# EAGLE design third (EAGLE 9.6.2)
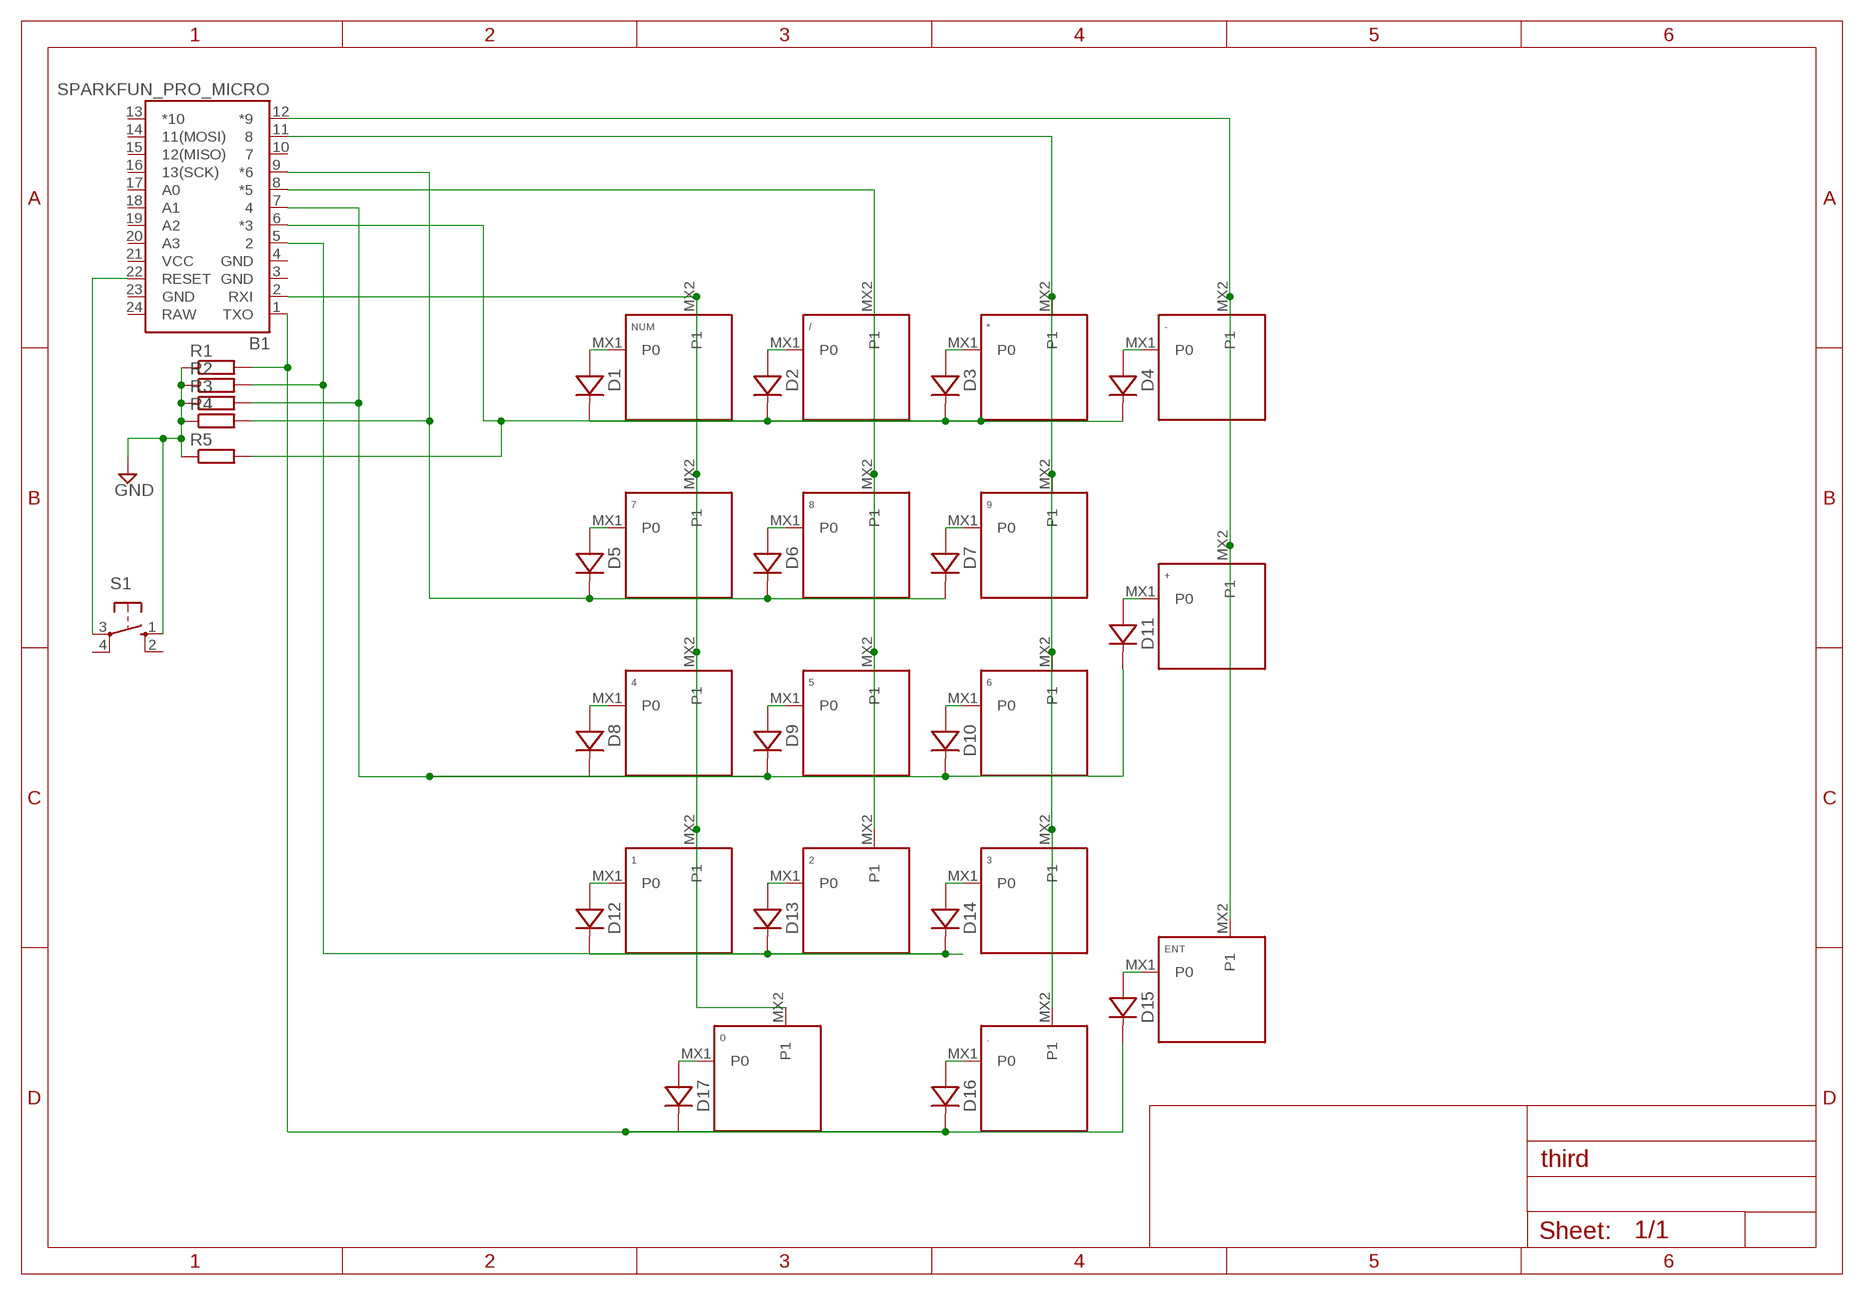
[diagram p0: schematic, sheet 1]

## Parts
0  KEYSWITCH-PLAIN-MX-2U-FLIPPED  [MX-2U-FLIPPED]
1  KEYSWITCH-PLAIN-MX-1U  [MX-1U]
2  KEYSWITCH-PLAIN-MX-1U  [MX-1U]
3  KEYSWITCH-PLAIN-MX-1U  [MX-1U]
4  KEYSWITCH-PLAIN-MX-1U  [MX-1U]
5  KEYSWITCH-PLAIN-MX-1U  [MX-1U]
6  KEYSWITCH-PLAIN-MX-1U  [MX-1U]
7  KEYSWITCH-PLAIN-MX-1U  [MX-1U]
8  KEYSWITCH-PLAIN-MX-1U  [MX-1U]
9  KEYSWITCH-PLAIN-MX-1U  [MX-1U]
*  KEYSWITCH-PLAIN-MX-1U  [MX-1U]
+  KEYSWITCH-PLAIN-MX-2U-ROTATED  [MX-2U-ROTATED]
-  KEYSWITCH-PLAIN-MX-1U  [MX-1U]
.  KEYSWITCH-PLAIN-MX-1U  [MX-1U]
/  KEYSWITCH-PLAIN-MX-1U  [MX-1U]
B1  SPARKFUN_PRO_MICRO  [SPARKFUN_PRO_MICRO]
D1  1N4148  DIODE-HAND  [DIODE_HAND]
D2  1N4148  DIODE-HAND  [DIODE_HAND]
D3  1N4148  DIODE-HAND  [DIODE_HAND]
D4  1N4148  DIODE-HAND  [DIODE_HAND]
D5  1N4148  DIODE-HAND  [DIODE_HAND]
D6  1N4148  DIODE-HAND  [DIODE_HAND]
D7  1N4148  DIODE-HAND  [DIODE_HAND]
D8  1N4148  DIODE-HAND  [DIODE_HAND]
D9  1N4148  DIODE-HAND  [DIODE_HAND]
D10  1N4148  DIODE-HAND  [DIODE_HAND]
D11  1N4148  DIODE-HAND  [DIODE_HAND]
D12  1N4148  DIODE-HAND  [DIODE_HAND]
D13  1N4148  DIODE-HAND  [DIODE_HAND]
D14  1N4148  DIODE-HAND  [DIODE_HAND]
D15  1N4148  DIODE-HAND  [DIODE_HAND]
D16  1N4148  DIODE-HAND  [DIODE_HAND]
D17  1N4148  DIODE-HAND  [DIODE_HAND]
ENT  KEYSWITCH-PLAIN-MX-2U-ROTATED  [MX-2U-ROTATED]
NUM  KEYSWITCH-PLAIN-MX-1U  [MX-1U]
R1  RESISTOR-THT  [THT-RESISTOR]
R2  RESISTOR-THT  [THT-RESISTOR]
R3  RESISTOR-THT  [THT-RESISTOR]
R4  RESISTOR-THT  [THT-RESISTOR]
R5  RESISTOR-THT  [THT-RESISTOR]
S1  10-XX  [B3F-10XX]

## Nets
GND: R1.1 R2.1 R3.1 R4.1 R5.1 S1.1(S)
N$1: D1.A1(A) D1.A2(A) D1.A3(A) NUM.MX1(P0)
N$2: /.MX1(P0) D2.A1(A) D2.A2(A) D2.A3(A)
N$3: *.MX1(P0) D3.A1(A) D3.A2(A) D3.A3(A)
N$4: -.MX1(P0) D4.A1(A) D4.A2(A) D4.A3(A)
N$5: 7.MX1(P0) D5.A1(A) D5.A2(A) D5.A3(A)
N$6: 8.MX1(P0) D6.A1(A) D6.A2(A) D6.A3(A)
N$7: 9.MX1(P0) D7.A1(A) D7.A2(A) D7.A3(A)
N$8: 4.MX1(P0) D8.A1(A) D8.A2(A) D8.A3(A)
N$9: 5.MX1(P0) D9.A1(A) D9.A2(A) D9.A3(A)
N$10: 6.MX1(P0) D10.A1(A) D10.A2(A) D10.A3(A)
N$11: +.MX1(P0) D11.A1(A) D11.A2(A) D11.A3(A)
N$12: 1.MX1(P0) D12.A1(A) D12.A2(A) D12.A3(A)
N$13: 2.MX1(P0) D13.A1(A) D13.A2(A) D13.A3(A)
N$14: 3.MX1(P0) D14.A1(A) D14.A2(A) D14.A3(A)
N$15: D15.A1(A) D15.A2(A) D15.A3(A) ENT.MX1(P0)
N$16: ..MX1(P0) D16.A1(A) D16.A2(A) D16.A3(A)
N$17: 0.MX1(P0) D17.A1(A) D17.A2(A) D17.A3(A)
N$18: 0.MX2(P1) 1.MX2(P1) 4.MX2(P1) 7.MX2(P1) B1.2(RXI) NUM.MX2(P1)
N$19: 2.MX2(P1) 5.MX2(P1) 8.MX2(P1) /.MX2(P1) B1.8(*5)
N$20: 3.MX2(P1) 6.MX2(P1) 9.MX2(P1) *.MX2(P1) ..MX2(P1) B1.11
N$21: B1.6(*3) D1.C1(C) D1.C2(C) D1.C3(C) D2.C1(C) D2.C2(C) D2.C3(C) D3.C1(C) D3.C2(C) D3.C3(C) D4.C1(C) D4.C2(C) D4.C3(C) R5.2
N$22: B1.9(*6) D5.C1(C) D5.C2(C) D5.C3(C) D6.C1(C) D6.C2(C) D6.C3(C) D7.C1(C) D7.C2(C) D7.C3(C) R4.2
N$23: B1.7 D8.C1(C) D8.C2(C) D8.C3(C) D9.C1(C) D9.C2(C) D9.C3(C) D10.C1(C) D10.C2(C) D10.C3(C) D11.C1(C) D11.C2(C) D11.C3(C) R3.2
N$24: B1.5 D12.C1(C) D12.C2(C) D12.C3(C) D13.C1(C) D13.C2(C) D13.C3(C) D14.C1(C) D14.C2(C) D14.C3(C) R2.2
N$25: B1.1(TXO) D15.C1(C) D15.C2(C) D15.C3(C) D16.C1(C) D16.C2(C) D16.C3(C) D17.C1(C) D17.C2(C) D17.C3(C) R1.2
N$26: B1.22(RESET) S1.3(P)
N$27: +.MX2(P1) -.MX2(P1) B1.12(*9) ENT.MX2(P1)
Unconnected: B1.10 B1.13(*10) B1.14(11(MOSI)) B1.15(12(MISO)) B1.16(13(SCK)) B1.17(A0) B1.18(A1) B1.19(A2) B1.20(A3) S1.2(S1) S1.4(P1)

## Power pins joined to a net without a drawn wire
GND: B1.3(GND) B1.4(GND) B1.23(GND)
RAW: B1.24(RAW)
VCC: B1.21(VCC)

## Library data of the parts
0 1-9 * + - . / ENT NUM = Keyboard:KEYSWITCH-PLAIN
B1 = SparkFun-Boards:SPARKFUN_PRO_MICRO: SparkFun Pro Micro Atmega32U4 compatible footprint. SparkFun Products: 3.3V/8MHz <https://www.sparkfun.com/products/12587> 5V/16MHz <https://www.sparkfun.com/products/12640>
D1-D17 = Components:DIODE: Standard 1N4148 diode
R1-R5 = Components:RESISTOR
S1 = switch-omron:10-XX: OMRON SWITCH; MPN: B3F-1000; OC_FARNELL: 176432; OC_NEWARK: 36M3542

## Board
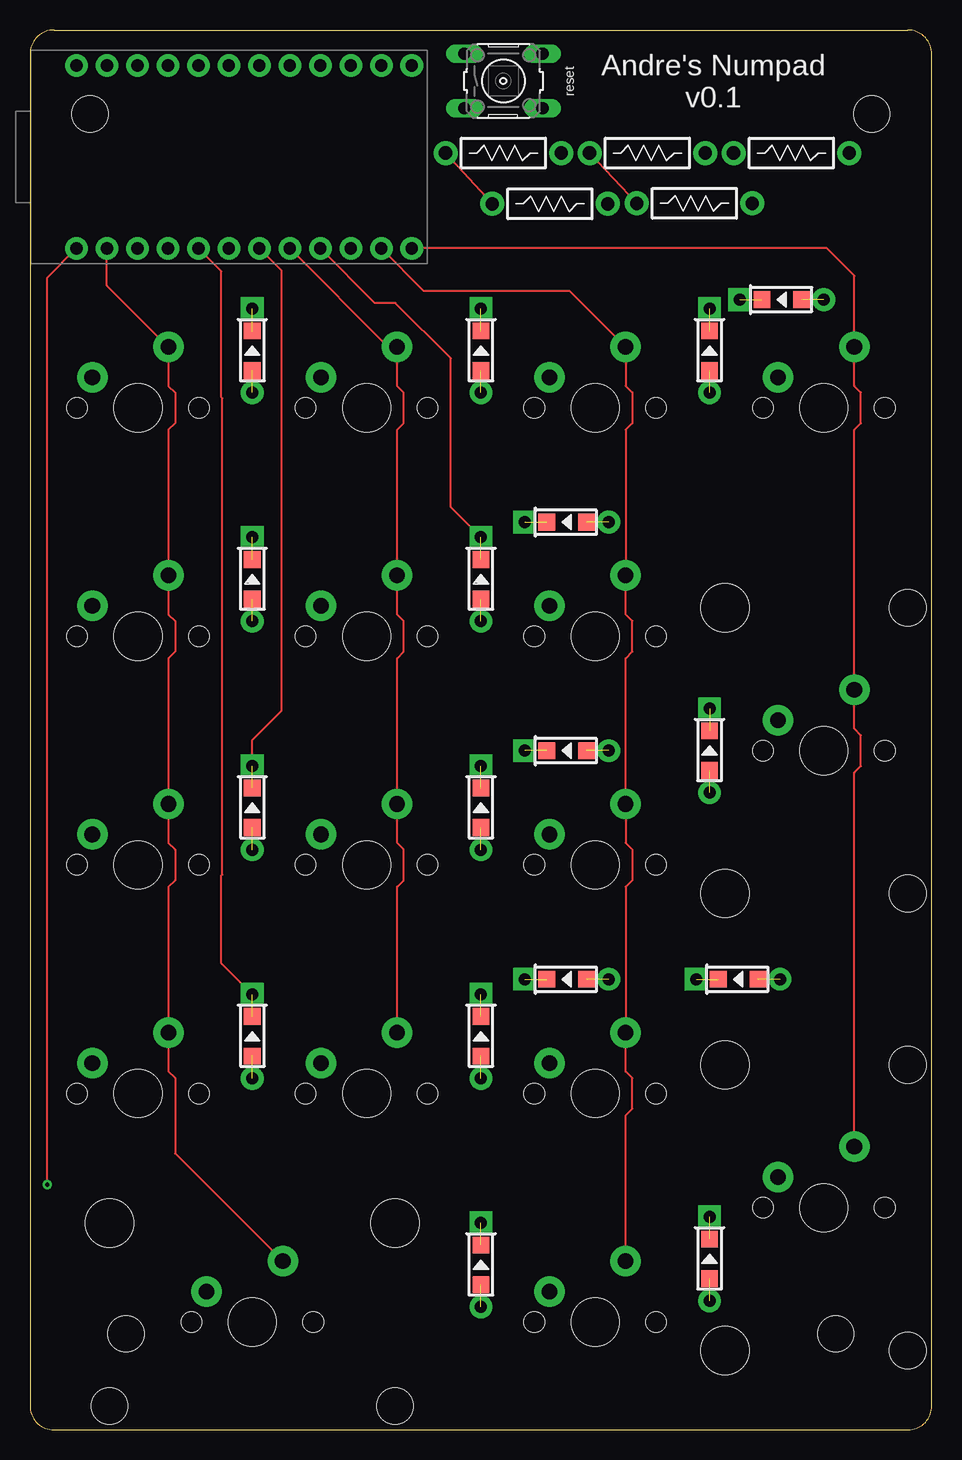
[diagram p1: board, top side]
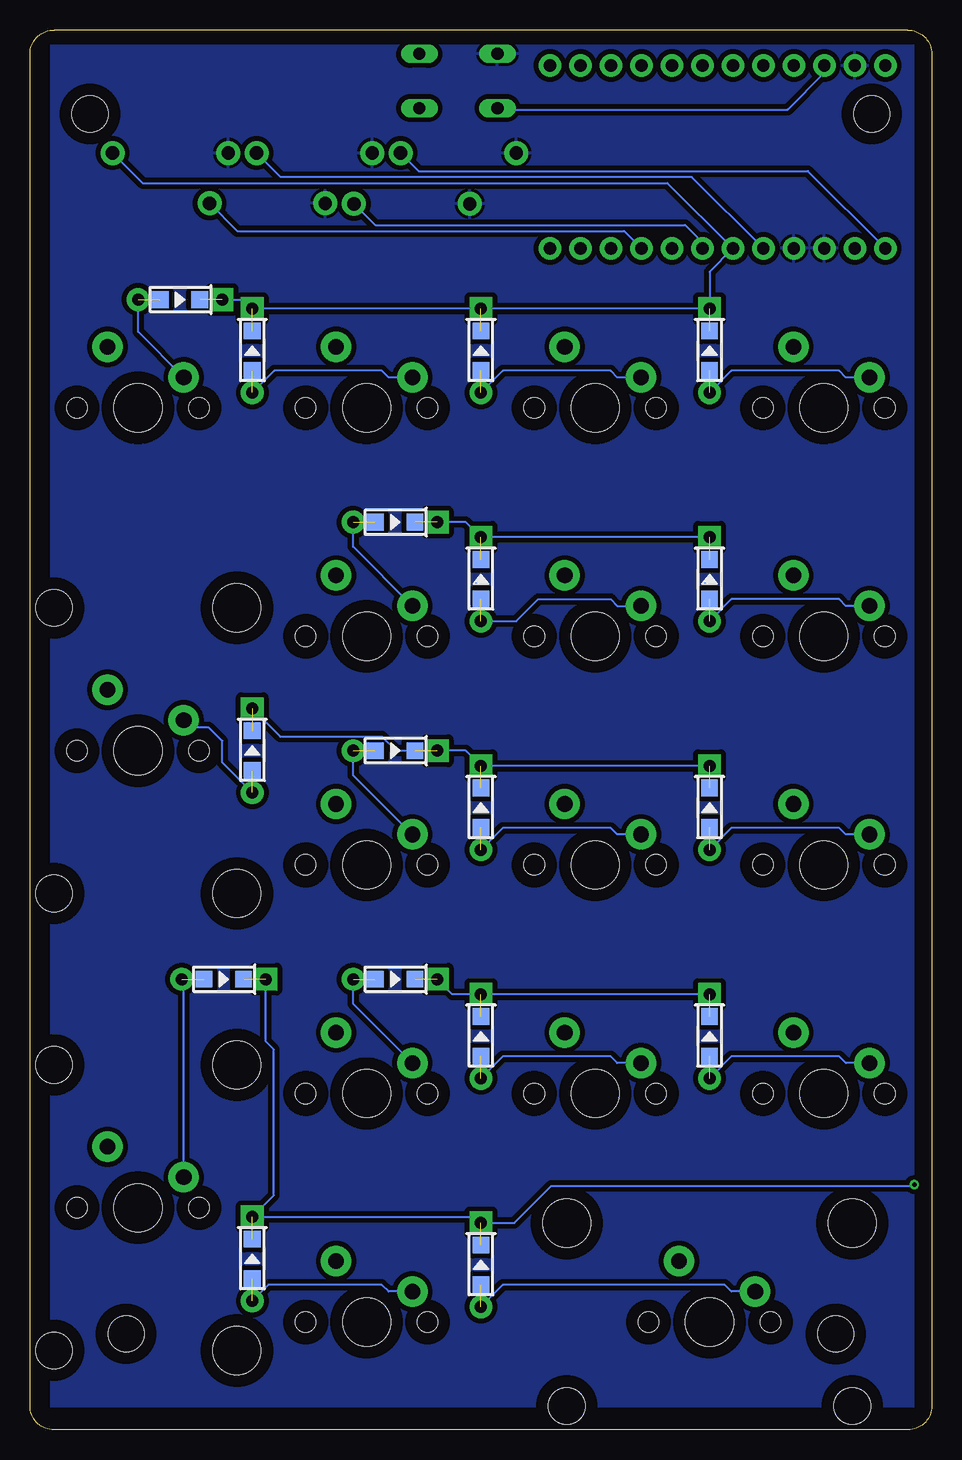
[diagram p2: board, bottom side, seen from below]

Size 75.15 x 116.7 mm. Coordinates in mm from the lower left corner, seen from the top.
Outline: 73.15,0 arc90 75.15,2
Outline: 0,2 arc90 2,0
Outline: 0,2 0,114.7 arc-90 2,116.7 73.15,116.7 arc-90 75.15,114.7 75.15,2
Outline: 2,0 73.15,0
Outline: 73.15,0 arc90 75.15,2
Outline: 0,2 arc90 2,0
Copper layers (1*16): Top 0.035mm / dielectric 1.5mm / Bottom 0.035mm
Design rules "default": minimum track width 6mil, minimum drill 0.35mm, track to track 6mil, track to pad 6mil, pad to pad 6mil, via to via 6mil, smd to smd 6mil, copper to edge 40mil, drill to drill 6mil, minimum pad ring 10mil, minimum via ring 8mil, stop-mask expansion 4mil, vias tented up to drill 0mil, thermal gap 10mil
Holes 3 mm at 5,109.71 70.15,109.7 67.14,8.01 8,8

### Footprints (pad centres in the part's own frame; a part is rotated, then mirrored left to right if it is on the bottom)
MX-2U-FLIPPED = drill 1.3 pad 2.54: MX1 -3.81,2.54; MX2 2.54,5.08 | hole 4: 0,0; -11.9,8.24; 11.9,8.24 | hole 1.7: -5.08,0; 5.08,0 | hole 3.05: -11.9,-7; 11.9,-7
MX-1U = drill 1.3 pad 2.54: MX1 -3.81,2.54; MX2 2.54,5.08 | hole 4: 0,0 | hole 1.7: -5.08,0; 5.08,0
MX-2U-ROTATED = drill 1.3 pad 2.54: MX1 -3.81,2.54; MX2 2.54,5.08 | hole 4: 0,0; -8.24,-11.9; -8.24,11.9 | hole 1.7: -5.08,0; 5.08,0 | hole 3.05: 7,-11.9; 7,11.9
SPARKFUN_PRO_MICRO = drill 1.016 pad 1.88: 1 -7.62,12.7; 2 -7.62,10.16; 3 -7.62,7.62; 4 -7.62,5.08; 5 -7.62,2.54; 6 -7.62,0; 7 -7.62,-2.54; 8 -7.62,-5.08; 9 -7.62,-7.62; 10 -7.62,-10.16; 11 -7.62,-12.7; 12 -7.62,-15.24; 13 7.62,-15.24; 14 7.62,-12.7; 15 7.62,-10.16; 16 7.62,-7.62; 17 7.62,-5.08; 18 7.62,-2.54; 19 7.62,0; 20 7.62,2.54; 21 7.62,5.08; 22 7.62,7.62; 23 7.62,10.16; 24 7.62,12.7
DIODE_HAND = smd 1.397 x 1.397: A1 -1.651,0; C1 1.651,0 | drill 1 pad 1.9: A2 -3.5,0 | smd 1.397 x 1.397 bottom: A3 -1.651,0; C3 1.651,0 | drill 1 pad 1.9 square: C2 3.5,0
THT-RESISTOR = drill 1.1 pad 2: 1 -4.82,0; 2 4.82,0
B3F-10XX = drill 1.016 long: 1 -3.251,2.261; 2 3.251,2.261; 3 -3.251,-2.261; 4 3.251,-2.261

### Placement (x,y rotation side)
0  18.52,9 0 top
1  9,28.05 0 top
2  28.05,28.05 0 top
3  47.1,28.05 0 top
4  9,47.1 0 top
5  28.05,47.1 0 top
6  47.1,47.1 0 top
7  9,66.15 0 top
8  28.05,66.15 0 top
9  47.1,66.15 0 top
*  47.1,85.2 0 top
+  66.15,56.62 0 top
-  66.15,85.2 0 top
.  47.1,9 0 top
/  28.05,85.2 0 top
B1  16.57,106.12 90 top
D1  18.52,89.96 90 top
D2  37.58,89.96 90 top
D3  56.62,89.96 90 top
D4  62.65,94.23 180 top
D5  18.52,70.91 90 top
D6  37.58,70.91 90 top
D7  44.72,75.67 180 top
D8  18.52,51.86 90 top
D9  37.58,51.86 90 top
D10  44.72,56.62 180 top
D11  56.62,56.62 90 top
D12  18.52,32.81 90 top
D13  37.58,32.81 90 top
D14  44.72,37.58 180 top
D15  59.01,37.58 180 top
D16  56.62,14.26 90 top
D17  37.58,13.76 90 top
ENT  66.15,18.52 0 top
NUM  9,85.2 0 top
R1  39.45,106.45 0 top
R2  51.45,106.45 0 top
R3  43.33,102.21 0 top
R4  55.37,102.25 0 top
R5  63.45,106.45 0 top
S1  39.45,112.45 0 top

### Tracks (layer width: path | path; a pad name or v marks a point on that pad's centre or on a via)
GND
  Top 0.152: R3.1 R1.1 | R4.1 R2.1
  pour Bottom (isolate 0.406): 1.45,1.95 1.45,115.45 73.45,115.45 73.45,1.95
N$1  (2 unrouted)
  Bottom 0.152: 5.91,87.02 NUM.MX1 7.17,87.74 7.72,88.29 16.7,88.29 D1.A2
N$2  (2 unrouted)
  Bottom 0.152: 24.96,87.02 /.MX1 26.22,87.74 26.77,88.29 35.75,88.29 D2.A2
N$3  (2 unrouted)
  Bottom 0.152: *.MX1 45.27,87.74 45.82,88.29 54.8,88.29 D3.A2
N$4  (2 unrouted)
  Bottom 0.152: -.MX1 66.15,91.55 D4.A2
N$5  (2 unrouted)
  Bottom 0.152: D5.A2 18.47,67.47 16.7,69.24 7.72,69.24 7.17,68.69 7.MX1
N$6  (2 unrouted)
  Bottom 0.152: D6.A2 34.61,67.41 32.78,69.24 26.77,69.24 26.22,68.69 8.MX1
N$7  (2 unrouted)
  Bottom 0.152: 9.MX1 48.22,73.62 D7.A2
N$8  (2 unrouted)
  Bottom 0.152: 5.91,48.92 4.MX1 7.17,49.64 7.72,50.19 16.7,50.19 D8.A2
N$9  (2 unrouted)
  Bottom 0.152: 24.96,48.92 5.MX1 26.22,49.64 26.77,50.19 35.75,50.19 D9.A2
N$10  (2 unrouted)
  Bottom 0.152: 6.MX1 48.22,54.57 D10.A2
N$11  (2 unrouted)
  Bottom 0.152: D11.A2 59.13,55.63 59.13,57.43 60.27,58.57 61.74,58.57 +.MX1
N$12  (2 unrouted)
  Bottom 0.152: 1.MX1 7.17,30.59 7.72,31.14 16.7,31.14 D12.A2
N$13  (2 unrouted)
  Bottom 0.152: 2.MX1 26.22,30.59 26.77,31.14 35.75,31.14 D13.A2
N$14  (2 unrouted)
  Bottom 0.152: 3.MX1 48.22,35.52 D14.A2
N$15  (2 unrouted)
  Bottom 0.152: ENT.MX1 62.34,37.41 D15.A2
N$16  (2 unrouted)
  Bottom 0.152: ..MX1 45.27,11.54 45.82,12.09 55.3,12.09 D16.A2
N$17  (2 unrouted)
  Bottom 0.152: 0.MX1 16.69,11.54 17.24,12.09 35.75,12.09 D17.A2
N$18
  Top 0.152: 0.MX2 12.09,23.05 12.09,29.33 11.54,29.88 1.MX2 11.54,45.27 12.09,45.82 12.09,48.38 11.54,48.93 4.MX2 11.54,64.32 12.09,64.87 12.09,67.43 11.54,67.98 7.MX2 11.54,83.37 12.09,83.92 12.09,86.48 11.54,87.03 NUM.MX2 6.41,95.41 B1.2
N$19
  Top 0.152: 2.MX2 30.59,45.27 31.14,45.82 31.14,48.38 30.59,48.93 5.MX2 30.59,64.32 31.14,64.87 31.14,67.43 30.59,67.98 8.MX2 30.59,83.37 31.14,83.92 31.14,86.48 30.59,87.03 /.MX2 29.87,90.28 B1.8
N$20
  Top 0.152: ..MX2 49.64,26.22 50.19,26.77 50.19,29.33 49.64,29.88 3.MX2 49.64,45.27 50.19,45.82 50.19,48.38 49.64,48.93 6.MX2 49.64,64.32 50.19,64.87 50.19,67.43 49.64,67.98 9.MX2 49.64,83.37 50.19,83.92 50.19,86.48 49.64,87.03 *.MX2 44.97,94.95 32.82,94.95 B1.11
N$21  (8 unrouted)
  Bottom 0.152: D4.C2 57.39,94.23 D3.C2 D2.C2 D1.C2 18.52,96.55 B1.6 22.03,103.95 65.77,103.95 R5.2
N$22  (6 unrouted)
  Top 0.152: D6.C2 35.07,76.92 35.07,89.33 30.45,93.95 28.74,93.95 B1.9
  Bottom 0.152: D5.C2 D6.C2 38.84,75.67 D7.C2 | R4.2 57.89,99.95 25.65,99.95 B1.9
N$23  (8 unrouted)
  Top 0.152: D8.C2 18.52,57.53 20.95,59.95 20.95,96.66 B1.7
  Bottom 0.152: D8.C2 D9.C2 38.84,56.62 D10.C2 44.65,56.62 45.83,57.8 54.3,57.8 D11.C2 | R3.2 46.39,100.45 20.57,100.45 19.11,99 B1.7
N$24  (6 unrouted)
  Top 0.152: D12.C2 15.95,38.89 15.95,46.22 16.02,46.3 16.02,86 15.95,86.08 15.95,96.58 B1.5
  Bottom 0.152: D14.C2 39.96,36.31 D13.C2 D12.C2 | B1.5 19.99,104.45 54.27,104.45 R2.2
N$25  (via drill 0.35)  (6 unrouted)
  Top 0.152: B1.1 1.45,96.07 v1.45,20.45
  Bottom 0.152: D15.C2 55.51,32.39 54.82,31.71 54.82,19.57 D16.C2 38.08,17.76 D17.C2 34.78,17.26 31.71,20.33 1.57,20.33 v1.45,20.45 | R1.2 42.77,104.95 10.33,104.95 B1.1
N$26
  Bottom 0.152: B1.22 8.95,113.13 12.01,110.07 36.08,110.07 S1.3
N$27
  Top 0.152: ENT.MX2 68.69,54.79 69.24,55.34 69.24,57.91 68.69,58.46 +.MX2 68.69,83.37 69.24,83.92 69.24,86.48 68.69,87.03 -.MX2 68.69,96.21 66.4,98.5 B1.12

### Text on the board
tPlace: reset | Andre's Numpad / v0.1